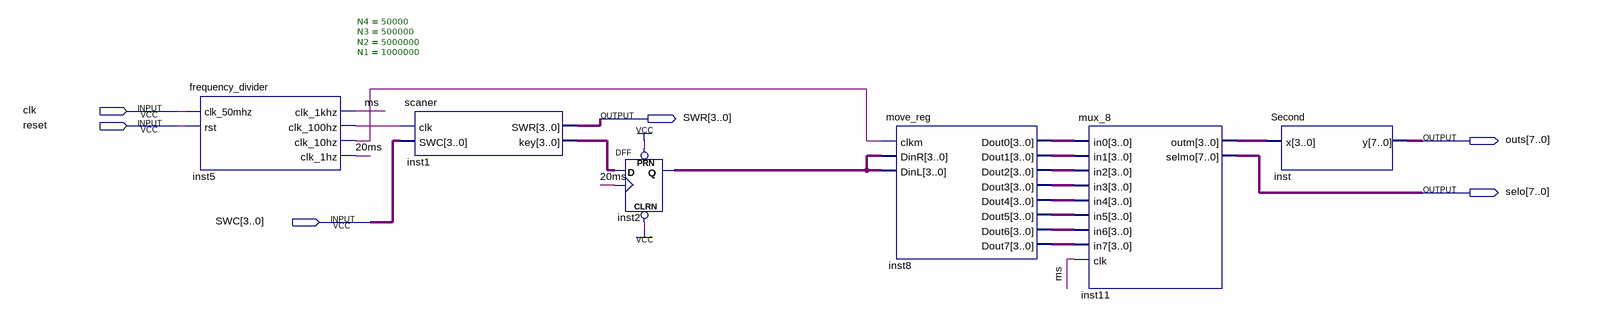
[diagram p0: schematic sheet]
// Quartus schematic Eleventhproject.bdf as structural Verilog: 6 symbols, 6 pins
module Eleventhproject (
  input  clk,
  input  reset,
  input  [3:0] SWC,
  output [3:0] SWR,
  output [7:0] outs,
  output [7:0] selo
);

  wire \20ms , inst5_clk_10hz, inst5_clk_100hz, ms;
  wire [3:0] inst1_key, inst2_q, inst8_dout0, inst8_dout1, inst8_dout2, inst8_dout3, inst8_dout4,
       inst8_dout5, inst8_dout6, inst8_dout7, inst11_outm;

  frequency_divider #(.N4(50000), .N3(500000), .N2(5000000), .N1(1000000)) inst5 (
    .clk_50mhz(clk), .rst(reset), .clk_1khz(ms), .clk_100hz(inst5_clk_100hz), .clk_10hz(inst5_clk_10hz),
    .clk_1hz(\20ms ));
  scaner inst1 (.clk(inst5_clk_100hz), .SWC(SWC), .SWR(SWR), .key(inst1_key));
  DFF inst2[3:0] (.CLRN(1'b1), .CLK(\20ms ), .D(inst1_key), .PRN(1'b1), .Q(inst2_q));
  move_reg inst8 (
    .clkm(inst5_clk_10hz), .DinR(inst2_q), .DinL(inst2_q), .Dout0(inst8_dout0), .Dout1(inst8_dout1),
    .Dout2(inst8_dout2), .Dout3(inst8_dout3), .Dout4(inst8_dout4), .Dout5(inst8_dout5), .Dout6(inst8_dout6),
    .Dout7(inst8_dout7));
  mux_8 inst11 (
    .in0(inst8_dout0), .in1(inst8_dout1), .in2(inst8_dout2), .in3(inst8_dout3), .in4(inst8_dout4),
    .in5(inst8_dout5), .in6(inst8_dout6), .in7(inst8_dout7), .clk(ms), .outm(inst11_outm), .selmo(selo));
  Second inst (.x(inst11_outm), .y(outs));
endmodule
